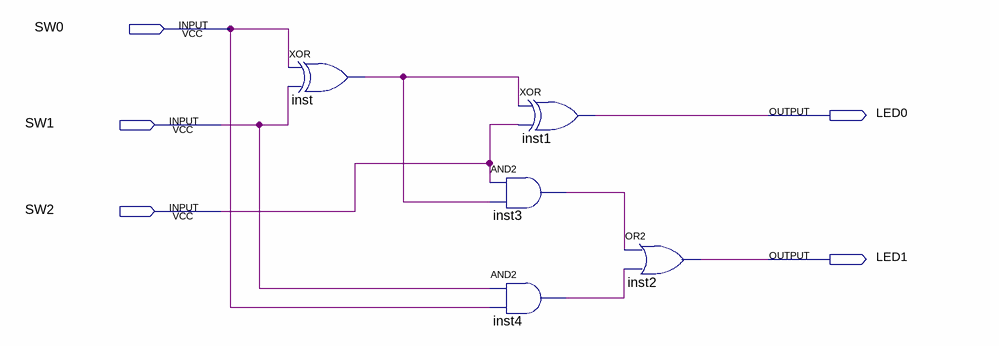
[diagram p0: schematic sheet]
// Quartus schematic exercise2.bdf as structural Verilog: 5 symbols, 5 pins
module exercise2 (
  input  SW0,
  input  SW1,
  input  SW2,
  output LED0,
  output LED1
);

  wire inst3_out, inst4_out, inst_out;

  xor inst (inst_out, SW0, SW1);
  xor inst1 (LED0, inst_out, SW2);
  and inst3 (inst3_out, SW2, inst_out);
  and inst4 (inst4_out, SW1, SW0);
  or inst2 (LED1, inst3_out, inst4_out);
endmodule
